# Altium project UZ_D_LEDebug.PrjPCB
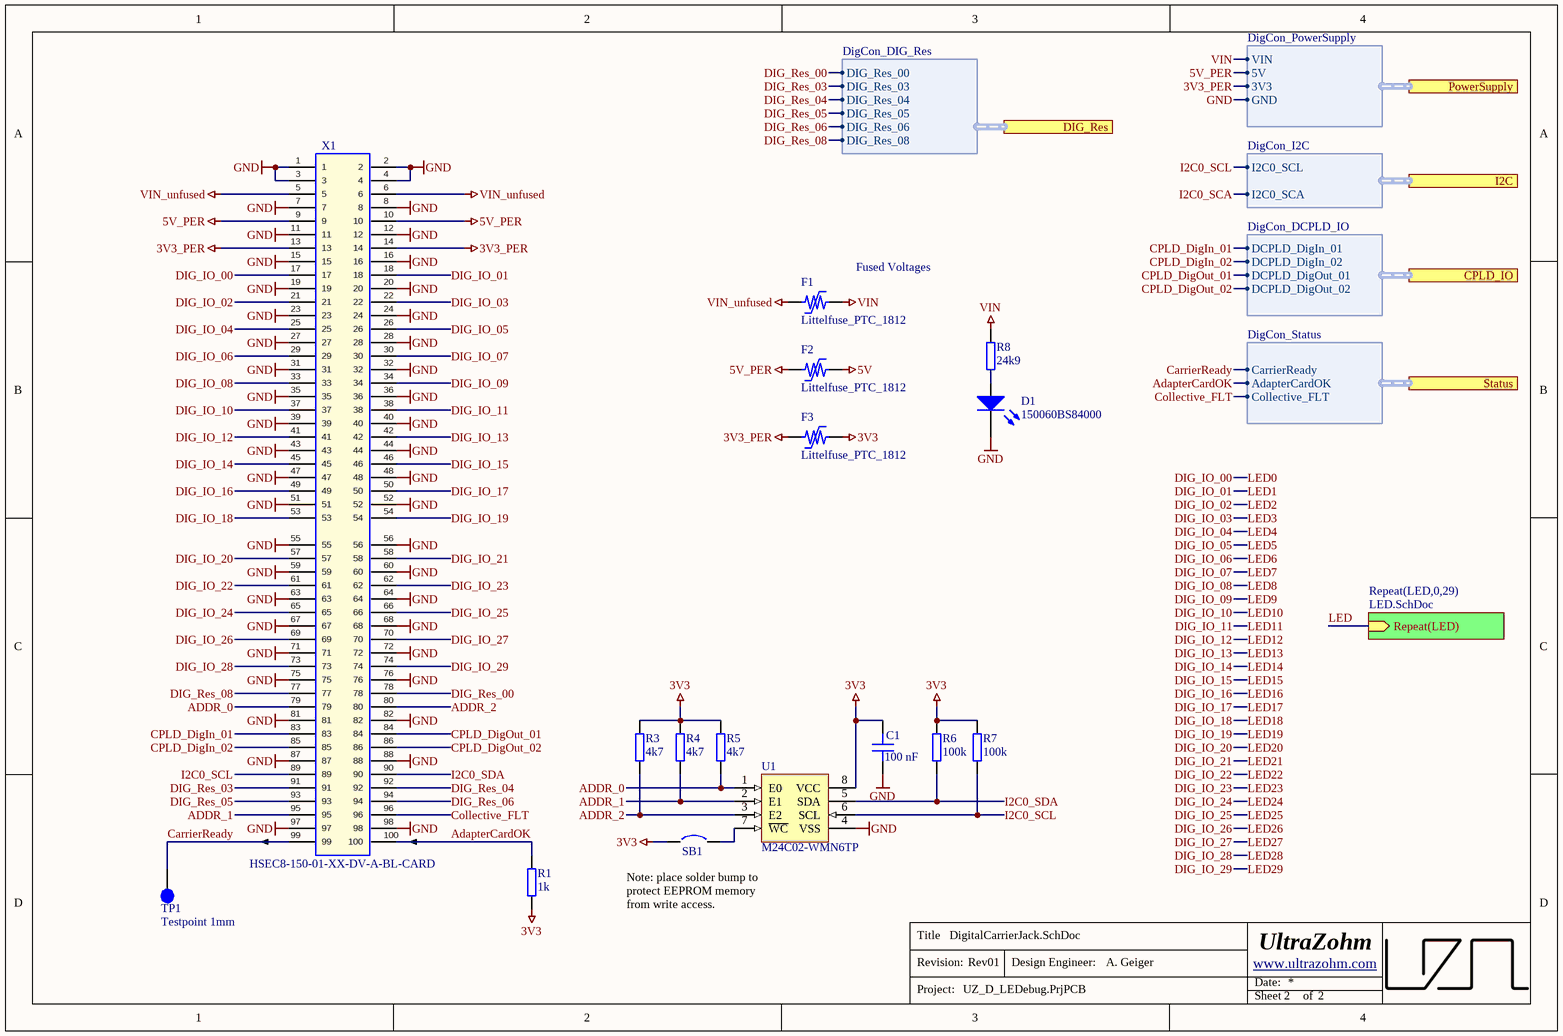
[diagram p0: DigitalCarrierJack.SchDoc]
Rev: 01; ProjectRevision: Rev01; ProjectDate: 01/2025; Project: UZ_D_LEDebug; PPP: 016; GGG: 000; AuthorParam: A. Geiger; Author: A. Geiger
2 sheets, 76 parts. Net scope: hierarchical (ports join the sheet entries above them; power ports are global).
Board file: UZ_D_LEDebug.PcbDoc
Sheets:
  DigitalCarrierJack.SchDoc
    LED0 = LED.SchDoc
    LED1 = LED.SchDoc
    LED2 = LED.SchDoc
    LED3 = LED.SchDoc
    LED4 = LED.SchDoc
    LED5 = LED.SchDoc
    LED6 = LED.SchDoc
    LED7 = LED.SchDoc
    LED8 = LED.SchDoc
    LED9 = LED.SchDoc
    LED10 = LED.SchDoc
    LED11 = LED.SchDoc
    LED12 = LED.SchDoc
    LED13 = LED.SchDoc
    LED14 = LED.SchDoc
    LED15 = LED.SchDoc
    LED16 = LED.SchDoc
    LED17 = LED.SchDoc
    LED18 = LED.SchDoc
    LED19 = LED.SchDoc
    LED20 = LED.SchDoc
    LED21 = LED.SchDoc
    LED22 = LED.SchDoc
    LED23 = LED.SchDoc
    LED24 = LED.SchDoc
    LED25 = LED.SchDoc
    LED26 = LED.SchDoc
    LED27 = LED.SchDoc
    LED28 = LED.SchDoc
    LED29 = LED.SchDoc

## Sheet DigitalCarrierJack.SchDoc
size A4; Author: A. Geiger; CompanyName: Technische Hochschule Nürnberg Georg Simon Ohm; Organization: UltraZohm; Address1: Kesslerplatz 12; Address2: 90489 Nürnberg; Address3: GERMANY; DocumentNumber: 2; SheetNumber: 2; SheetTotal: 2; Website: www.ultrazohm.com

### Parts
C1  100 nF  [C_0603]
D1  150060BS84000  [WL-SMCW_0603]
F1  Littelfuse_PTC_1812  [1812_PTC_Polyfuse_Littelfuse]
F2  Littelfuse_PTC_1812  [1812_PTC_Polyfuse_Littelfuse]
F3  Littelfuse_PTC_1812  [1812_PTC_Polyfuse_Littelfuse]
R1  1k  [R_0603_TE]
R3  4k7  [RES 0603_1608]
R4  4k7  [RES 0603_1608]
R5  4k7  [RES 0603_1608]
R6  100k  [RES 0603_1608]
R7  100k  [RES 0603_1608]
R8  24k9  [RES 0603_1608]
SB1  Solder Bump 0603  [SB_0603]  (value not drawn)  (no BOM)
TP1  Testpoint 1mm  [TP_1mm]  (no BOM)
U1  M24C02-WMN6TP  [D0008A_N]
X1  HSEC8-150-01-XX-DV-A-BL-CARD  [HSEC8-150-01-XX-DV-A-BL-CARD]  (no BOM)

### Sub-sheets
Repeat(LED,0,29) = LED.SchDoc: Repeat(LED) (in)

### Ports
CPLD_IO (harness DigCon_DCPLD_IO), DIG_Res (harness DigCon_DIG_Res), I2C (harness DigCon_I2C), PowerSupply (harness DigCon_PowerSupply), Status (harness DigCon_Status)

### Harnesses
DigCon_PowerSupply: GND, 3V3, 5V, VIN
DigCon_I2C: I2C0_SCA, I2C0_SCL
DigCon_Status: CarrierReady, AdapterCardOK, Collective_FLT
DigCon_DCPLD_IO: DCPLD_DigIn_01, DCPLD_DigIn_02, DCPLD_DigOut_01, DCPLD_DigOut_02
DigCon_DIG_Res: DIG_Res_03, DIG_Res_04, DIG_Res_05, DIG_Res_06, DIG_Res_00, DIG_Res_08

### Nets
3V3: C1.1 F3.2 R1.1 R3.2 R4.2 R5.2 R6.2 R7.2 SB1.1 U1.8(VCC)
3V3_PER: F3.1 X1.13 X1.14 ; port PowerSupply.3V3
5V: F2.2
5V_PER: F2.1 X1.9 X1.10 ; port PowerSupply.5V
GND: C1.2 D1.1(K) U1.4(VSS) X1.1 X1.2 X1.3 X1.4 X1.7 X1.8 X1.11 X1.12 X1.15 X1.16 X1.19 X1.20 X1.23 X1.24 X1.27 X1.28 X1.31 X1.32 X1.35 X1.36 X1.39 X1.40 X1.43 X1.44 X1.47 X1.48 X1.51 X1.52 X1.55 X1.56 X1.59 X1.60 X1.63 X1.64 X1.67 X1.68 X1.71 X1.72 X1.75 X1.76 X1.81 X1.82 X1.87 X1.88 X1.97 X1.98 ; port PowerSupply.GND
VIN: F1.2 R8.2 ; port PowerSupply.VIN
VIN_unfused: F1.1 X1.5 X1.6
AdapterCardOK: R1.2 X1.100 ; port Status.AdapterCardOK
ADDR_0: R5.1 U1.1(E0) X1.79
ADDR_1: R4.1 U1.2(E1) X1.95
ADDR_2: R3.1 U1.3(E2) X1.80
CarrierReady: TP1.1 X1.99 ; port Status.CarrierReady
Collective_FLT: X1.96 ; port Status.Collective_FLT
CPLD_DigIn_01: X1.83 ; port CPLD_IO.DCPLD_DigIn_01
CPLD_DigIn_02: X1.85 ; port CPLD_IO.DCPLD_DigIn_02
CPLD_DigOut_01: X1.84 ; port CPLD_IO.DCPLD_DigOut_01
CPLD_DigOut_02: X1.86 ; port CPLD_IO.DCPLD_DigOut_02
DIG_IO_00: X1.17  [also labelled LED0]
DIG_IO_01: X1.18  [also labelled LED1]
DIG_IO_02: X1.21  [also labelled LED2]
DIG_IO_03: X1.22  [also labelled LED3]
DIG_IO_04: X1.25  [also labelled LED4]
DIG_IO_05: X1.26  [also labelled LED5]
DIG_IO_06: X1.29  [also labelled LED6]
DIG_IO_07: X1.30  [also labelled LED7]
DIG_IO_08: X1.33  [also labelled LED8]
DIG_IO_09: X1.34  [also labelled LED9]
DIG_IO_10: X1.37  [also labelled LED10]
DIG_IO_11: X1.38  [also labelled LED11]
DIG_IO_12: X1.41  [also labelled LED12]
DIG_IO_13: X1.42  [also labelled LED13]
DIG_IO_14: X1.45  [also labelled LED14]
DIG_IO_15: X1.46  [also labelled LED15]
DIG_IO_16: X1.49  [also labelled LED16]
DIG_IO_17: X1.50  [also labelled LED17]
DIG_IO_18: X1.53  [also labelled LED18]
DIG_IO_19: X1.54  [also labelled LED19]
DIG_IO_20: X1.57  [also labelled LED20]
DIG_IO_21: X1.58  [also labelled LED21]
DIG_IO_22: X1.61  [also labelled LED22]
DIG_IO_23: X1.62  [also labelled LED23]
DIG_IO_24: X1.65  [also labelled LED24]
DIG_IO_25: X1.66  [also labelled LED25]
DIG_IO_26: X1.69  [also labelled LED26]
DIG_IO_27: X1.70  [also labelled LED27]
DIG_IO_28: X1.73  [also labelled LED28]
DIG_IO_29: X1.74  [also labelled LED29]
DIG_Res_00: X1.78 ; port DIG_Res.DIG_Res_00
DIG_Res_03: X1.91 ; port DIG_Res.DIG_Res_03
DIG_Res_04: X1.92 ; port DIG_Res.DIG_Res_04
DIG_Res_05: X1.93 ; port DIG_Res.DIG_Res_05
DIG_Res_06: X1.94 ; port DIG_Res.DIG_Res_06
DIG_Res_08: X1.77 ; port DIG_Res.DIG_Res_08
I2C0_SCA: port I2C.I2C0_SCA
I2C0_SCL: R7.1 U1.6(SCL) X1.89 ; port I2C.I2C0_SCL
I2C0_SDA: R6.1 U1.5(SDA) X1.90
LED: sheet Repeat(LED,0,29)/Repeat(LED)
NetD1_2: D1.2(A) R8.1
NetSB1_2: SB1.2 U1.7(~{WC})

### Notes on the sheet
- (near F1) Fused Voltages
- Note: place solder bump to protect EEPROM memory from write access.
- Title
- Revision:
- Design Engineer:
- Date:
- Project:
- Sheet
- of

### Library data of the parts
C1 = C0603C104K9PACTU: Capacitor 0603, 6.3 VDC, 100 nF, X5R; Manufacturer: KEMET; Tolerance: 10 %; Voltage Rating: 6.3 VDC; Created from: MGremer; Manufacturer Part Number: C0603C104K9PACTU; PartID: 70; Created On: 20.12.2020 13:54:13; ComponentLink1Description: Datasheet; ComponentLink1URL: https://www.mouser.de/datasheet/2/212/KEM_C1006_X5R_SMD-1103249.pdf; Component Type: Capacitor 0603; Device Package: 0603; Last Updated: 20.01.2021 13:57:36; Mounting Type: SMD; Operating Temperature: -55 - 85°C; Series: SMD Comm X5R; Supplier 1: Mouser; Supplier Part Number 1: 80-C0603C104K9P; Type: Capacitor; Value: 100 nF; Live Cycle Status: 1; Stock number: not stored
D1 = 150060BS84000: WL-SMCW SMD Mono-color Chip LED Waterclear Blue; Manufacturer: Wuerth Elektronik; Type: Standard; Created from: MGremer; Forward Current I_f: 20 mA; Forward Voltage U_f: 3.2 V; Wavelength: 470 nm; Light Intensity: 560 mcd; Nominal Power: 78 mW; Manufacturer Part Number: 150060BS84000; PartID: 1; Created On: 08.12.2020 10:19:38; ComponentLink1Description: Datasheet; ComponentLink1URL: https://www.mouser.de/datasheet/2/445/150060BS84000-1838909.pdf; Component Type: LED Diode; Device Package: 0603; Last Updated: 03.03.2021 09:59:51; Mounting Type: SMD; Operating Temperature: -40 - 85 °C; Supplier 1: Mouser; Supplier Part Number 1: 710-150060BS84000; Supplier 2: Farnell; Supplier Part Number 2: 3408611; Supplier 3: Digi-Key; Supplier Part Number 3: 732-150060BS84000CT-ND; Live Cycle Status: 1; Stock number: not stored; Color: blue; LCSC Part Number: C965807
F1-F3 = Littelfuse_PTC_1812: POLYSWITCH RESETTABLE DEVICES; MPN: miniASMDC110F/24; Value: PTC, 1.1 A, 24V; Voltage: 24V; Trip Current: 2.2A; Hold Current: 1.1A; Resistance: 0.18 Ohm; Type: Fuse; Nominal current: 1 A; Created from: MHlatky; MF: Littelfuse; Created: 2019_02_10_AGeiger; Package: 1812; ComponentLink1URL: https://www.littelfuse.com/~/media/electronics/datasheets/resettable_ptcs/littelfuse_ptc_surface_mount_catalog_datasheet.pdf.pdf; ComponentLink1Description: Datasheet; Manufacturer Part Number: Littelfuse_PTC_1812; PartID: 5; Created On: 07.05.2021 06:50:33; Component Type: Littelfuse_PTC_1812; Last Updated: 27.05.2022 15:06:17; Manufacturer: Littelfuse; Mounting Type: SMD; Operating Temperature: -40 - 85 °C; Supplier 1: Mouser; Supplier Part Number 1: 530-0ZCG0150BF2C; Live Cycle Status: 1; LCSC Part Number: C70119
R1 = UZgen_R_0603_1k: Generic resistor; Manufacturer: UZgen; Tolerance: 1 %; Created from: UZgenTool; Manufacturer Part Number: UZgen_R_0603_1k; PartID: 221; Created On: 02.07.2024 17:29:49; Value: 1k; Device Package: 0603; Mounting Type: SMD; Last Updated: 02.07.2024 17:29:49
R3-R5 = 0603WAF4701T5E: SMD resistor E24 series; Manufacturer: UNI-ROYAL; Tolerance: 1%; Created from: AGeiger; Manufacturer Part Number: 0603WAF4701T5E; PartID: 90; Created On: 14.12.2020 16:17:14; ComponentLink1Description: Datasheet; ComponentLink1URL: https://datasheet.lcsc.com/lcsc/2206010116_UNI-ROYAL-Uniroyal-Elec-0603WAF4701T5E_C23162.pdf; Component Type: SMD resistor; Device Package: 0603; Last Updated: 25.08.2022 20:03:04; Mounting Type: SMD; Supplier 1: LCSC; Supplier Part Number 1: C23162; Type: Resistor; Value: 4k7; Live Cycle Status: 1; Stock number: Labor SMD Container; LCSC Part Number: C23162
R6 R7 = RK73B1JTTD104J: SMD resistor E24 series; Manufacturer: KOA Speer; Tolerance: 5%; Created from: MGremer; Manufacturer Part Number: RK73B1JTTD104J; PartID: 122; Created On: 14.12.2020 16:17:14; ComponentLink1Description: Datasheet; ComponentLink1URL: https://www.mouser.de/datasheet/2/219/RK73B-1825463.pdf; Component Type: SMD resistor; Device Package: 0603; Last Updated: 27.05.2022 14:04:10; Mounting Type: SMD; Supplier 1: Mouser; Supplier Part Number 1: 660-RK73B1JTTD104J; Type: Resistor; Value: 100k; Live Cycle Status: 1; Stock number: Labor SMD Container; LCSC Part Number: C25803
R8 = CRCW060324K9FKEA: SMD resistor 1%; Manufacturer: Vishay; Created from: MGremer; Manufacturer Part Number: CRCW060324K9FKEA; PartID: 157; Created On: 14.12.2020 16:17:14; ComponentLink1Description: Datasheet; ComponentLink1URL: https://www.mouser.de/datasheet/2/427/dcrcwe3-1762152.pdf; Component Type: SMD resistor; Device Package: 0603; Last Updated: 02.03.2021 14:07:32; Mounting Type: SMD; Supplier 1: Mouser; Supplier Part Number 1: 71-CRCW0603-24.9K-E3; Type: Resistor; Tolerance: 1%; Value: 24k9; Live Cycle Status: 1; Stock number: not stored
SB1 = =Value: Created from: AGeiger; Revision: July-2002: Re-released for DXP Platform.; PartID: 1; Created On: 09.01.2024 17:13:56; Component Type: Solder Bump; Device Package: 0603; Last Updated: 09.01.2024 17:13:56; Manufacturer Part Number: Solder Bump 0603; Mounting Type: SMD; Value: Solder Bump 0603
TP1 = NULL: Manufacturer Part Number: NULL; Created from: AGeiger; Created: 2018_06_25_AGeiger; Value: Testpoint 1mm; PartID: 9; Created On: 20.09.2022 13:14:57; Component Type: Testpoint; Last Updated: 20.09.2022 13:15:39; Manufacturer: NULL; Supplier 1: NULL; Supplier Part Number 1: NULL; Type: Testpoint; Live Cycle Status: 1
U1 = M24C02-WMN6TP: 2Kbit I2C SOP-8 EEPROM ROHS; Manufacturer: STMicroelectronics; Created from: AGeiger; Manufacturer Part Number: M24C02-WMN6TP; PartID: 1; Created On: 19.11.2023 14:54:27; ComponentLink1Description: Datasheet; ComponentLink1URL: https://www.st.com/resource/en/datasheet/m24c01-w.pdf; Component Type: EEPROM; Device Package: SOIC-8; Last Updated: 19.11.2023 21:39:04; Mounting Type: SMD; Operating Temperature: -40 to +85 °C; Series: M24xxx; Supplier 1: Mouser; Supplier Part Number 1: 511-M24C02-WMN6TP; Supplier 2: LCSC; Supplier Part Number 2: C7562; Type: Memory; Value: M24C02-WMN6TP; LCSC Part Number: C7562
X1 = HSEC8-150-01-XX-DV-A-BL-CARD: Mating Card Layout for HSEC8-150-01-XX-DV-A-BL; Manufacturer: SAMTEC; Created: 2018_04_23_AGeiger; Value: HSEC8-150-01-XX-DV-A-BL-CARD

## Sheet LED.SchDoc
size A4; Author: A. Geiger; CompanyName: Technische Hochschule Nürnberg Georg Simon Ohm; Organization: UltraZohm; Address1: Kesslerplatz 12; Address2: 90489 Nürnberg; Address3: GERMANY; DocumentNumber: 2; SheetNumber: 2; SheetTotal: 2; Website: www.ultrazohm.com
Used 30 times, as channels LED0, LED1, LED2, LED3, LED4, LED5, LED6, LED7, LED8, LED9, LED10, LED11, LED12, LED13, LED14, LED15, LED16, LED17, LED18, LED19, LED20, LED21, LED22, LED23, LED24, LED25, LED26, LED27, LED28, LED29. Parts and nets are listed once, with the designators drawn on the sheet.
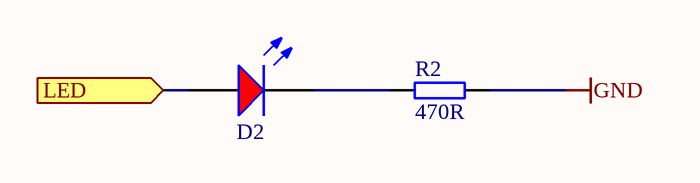
[diagram p1: LED.SchDoc]

### Parts
D2  LED Red  [WL-SMCW_0603]  (value not drawn)
R2  470R  [R_0603_TE]

### Ports
LED (in)

### Nets
GND: R2.2
LED: D2.2(A) ; port LED
NetD2_1: D2.1(K) R2.1

### Channels
LED0: designators end in AD; ports LED=DIG_IO_00
LED1: designators end in A; ports LED=DIG_IO_01
LED2: designators end in B; ports LED=DIG_IO_02
LED3: designators end in C; ports LED=DIG_IO_03
LED4: designators end in D; ports LED=DIG_IO_04
LED5: designators end in E; ports LED=DIG_IO_05
LED6: designators end in F; ports LED=DIG_IO_06
LED7: designators end in G; ports LED=DIG_IO_07
LED8: designators end in H; ports LED=DIG_IO_08
LED9: designators end in I; ports LED=DIG_IO_09
LED10: designators end in J; ports LED=DIG_IO_10
LED11: designators end in K; ports LED=DIG_IO_11
LED12: designators end in L; ports LED=DIG_IO_12
LED13: designators end in M; ports LED=DIG_IO_13
LED14: designators end in N; ports LED=DIG_IO_14
LED15: designators end in O; ports LED=DIG_IO_15
LED16: designators end in P; ports LED=DIG_IO_16
LED17: designators end in Q; ports LED=DIG_IO_17
LED18: designators end in R; ports LED=DIG_IO_18
LED19: designators end in S; ports LED=DIG_IO_19
LED20: designators end in T; ports LED=DIG_IO_20
LED21: designators end in U; ports LED=DIG_IO_21
LED22: designators end in V; ports LED=DIG_IO_22
LED23: designators end in W; ports LED=DIG_IO_23
LED24: designators end in X; ports LED=DIG_IO_24
LED25: designators end in Y; ports LED=DIG_IO_25
LED26: designators end in Z; ports LED=DIG_IO_26
LED27: designators end in AA; ports LED=DIG_IO_27
LED28: designators end in AB; ports LED=DIG_IO_28
LED29: designators end in AC; ports LED=DIG_IO_29

### Notes on the sheet
- Title
- Revision:
- Design Engineer:
- Date:
- Project:
- Sheet
- of

### Library data of the parts
D2 = UZgen_LED_0603_Red: Standard LEDs - SMD 0603 red; Manufacturer: UZgen; Created from: UZgenTool; Manufacturer Part Number: UZgen_LED_0603_Red; PartID: 22; Created On: 09/09/2024 10:45:01; ComponentLink1Description: N/A; ComponentLink1URL: N/A; Component Type: LED Diode; Device Package: 0603; Last Updated: 09/09/2024 10:45:01; Mounting Type: SMD; Supplier 1: LCSC; Supplier Part Number 1: C2286; Type: Standard; Value: LED Red; Live Cycle Status: 1; Stock number: not stored; Color: red; LCSC Part Number: C2286
R2 = UZgen_R_0603_470R: Generic resistor; Manufacturer: UZgen; Tolerance: 1 %; Created from: UZgenTool; Manufacturer Part Number: UZgen_R_0603_470R; PartID: 213; Created On: 02.07.2024 17:29:49; Device Package: 0603; Last Updated: 02.07.2024 17:29:49; Mounting Type: SMD; Value: 470R

## Nets that join several sheets
GND: DigitalCarrierJack (49 pins), LED0 (R2AD.2), LED1 (R2A.2), LED2 (R2B.2), LED3 (R2C.2), LED4 (R2D.2), LED5 (R2E.2), LED6 (R2F.2), LED7 (R2G.2), LED8 (R2H.2), LED9 (R2I.2), LED10 (R2J.2), LED11 (R2K.2), LED12 (R2L.2), LED13 (R2M.2), LED14 (R2N.2), LED15 (R2O.2), LED16 (R2P.2), LED17 (R2Q.2), LED18 (R2R.2), LED19 (R2S.2), LED20 (R2T.2), LED21 (R2U.2), LED22 (R2V.2), LED23 (R2W.2), LED24 (R2X.2), LED25 (R2Y.2), LED26 (R2Z.2), LED27 (R2AA.2), LED28 (R2AB.2), LED29 (R2AC.2)
DIG_IO_00: DigitalCarrierJack (X1.17), LED0 (D2AD.2)
DIG_IO_01: DigitalCarrierJack (X1.18), LED1 (D2A.2)
DIG_IO_02: DigitalCarrierJack (X1.21), LED2 (D2B.2)
DIG_IO_03: DigitalCarrierJack (X1.22), LED3 (D2C.2)
DIG_IO_04: DigitalCarrierJack (X1.25), LED4 (D2D.2)
DIG_IO_05: DigitalCarrierJack (X1.26), LED5 (D2E.2)
DIG_IO_06: DigitalCarrierJack (X1.29), LED6 (D2F.2)
DIG_IO_07: DigitalCarrierJack (X1.30), LED7 (D2G.2)
DIG_IO_08: DigitalCarrierJack (X1.33), LED8 (D2H.2)
DIG_IO_09: DigitalCarrierJack (X1.34), LED9 (D2I.2)
DIG_IO_10: DigitalCarrierJack (X1.37), LED10 (D2J.2)
DIG_IO_11: DigitalCarrierJack (X1.38), LED11 (D2K.2)
DIG_IO_12: DigitalCarrierJack (X1.41), LED12 (D2L.2)
DIG_IO_13: DigitalCarrierJack (X1.42), LED13 (D2M.2)
DIG_IO_14: DigitalCarrierJack (X1.45), LED14 (D2N.2)
DIG_IO_15: DigitalCarrierJack (X1.46), LED15 (D2O.2)
DIG_IO_16: DigitalCarrierJack (X1.49), LED16 (D2P.2)
DIG_IO_17: DigitalCarrierJack (X1.50), LED17 (D2Q.2)
DIG_IO_18: DigitalCarrierJack (X1.53), LED18 (D2R.2)
DIG_IO_19: DigitalCarrierJack (X1.54), LED19 (D2S.2)
DIG_IO_20: DigitalCarrierJack (X1.57), LED20 (D2T.2)
DIG_IO_21: DigitalCarrierJack (X1.58), LED21 (D2U.2)
DIG_IO_22: DigitalCarrierJack (X1.61), LED22 (D2V.2)
DIG_IO_23: DigitalCarrierJack (X1.62), LED23 (D2W.2)
DIG_IO_24: DigitalCarrierJack (X1.65), LED24 (D2X.2)
DIG_IO_25: DigitalCarrierJack (X1.66), LED25 (D2Y.2)
DIG_IO_26: DigitalCarrierJack (X1.69), LED26 (D2Z.2)
DIG_IO_27: DigitalCarrierJack (X1.70), LED27 (D2AA.2)
DIG_IO_28: DigitalCarrierJack (X1.73), LED28 (D2AB.2)
DIG_IO_29: DigitalCarrierJack (X1.74), LED29 (D2AC.2)

## Assembly variants
Default: all parts fitted